# EAGLE schematic doorbell (EAGLE 9.1.3)
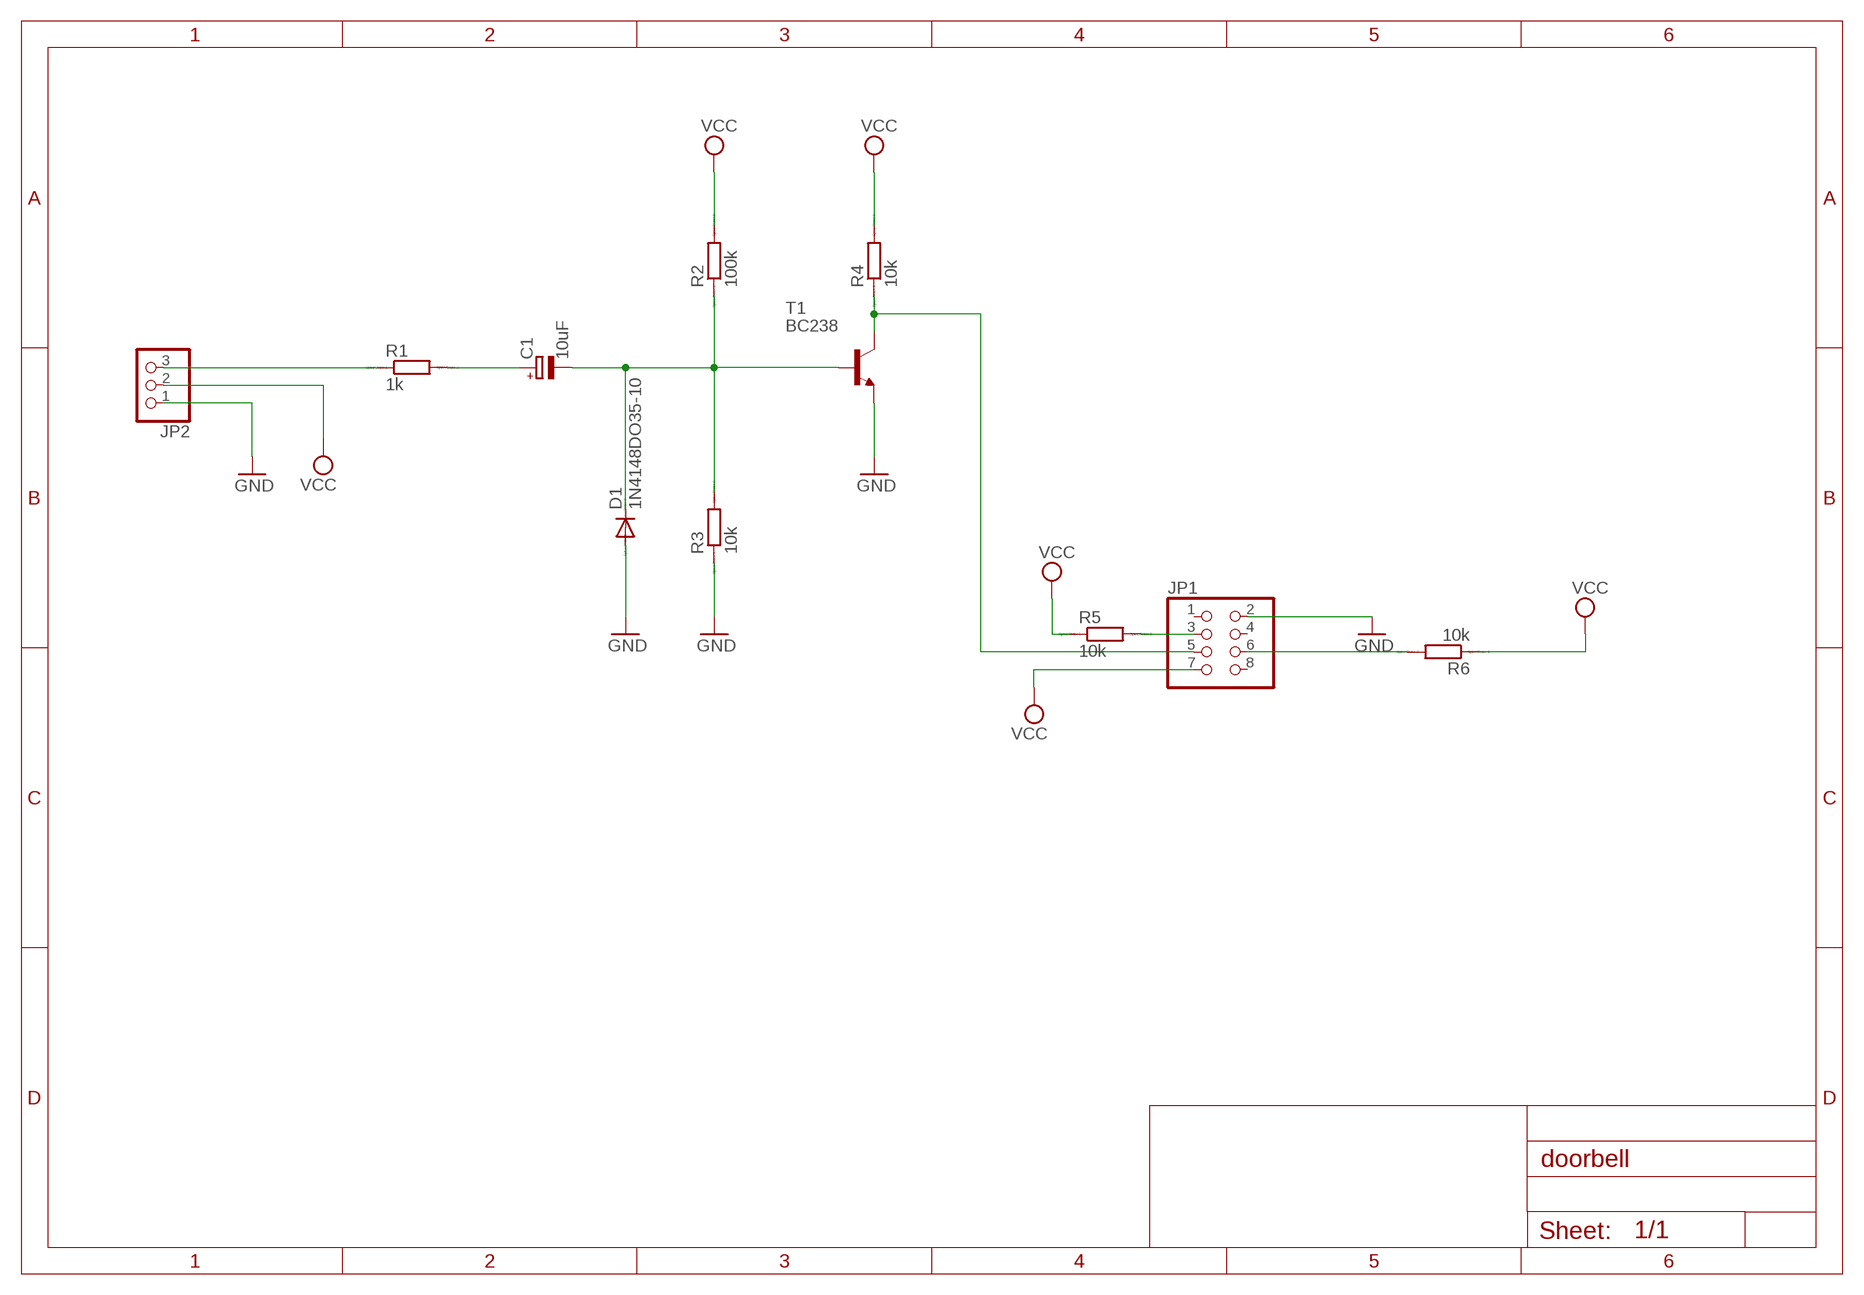
[diagram p0: schematic, sheet 1]

## Parts
C1  10uF  CPOL-EUE2,5-6E  [E2,5-6E]
D1  1N4148DO35-10  [DO35-10]
JP1  PINHD-2X4  [2X04]
JP2  PINHD-1X3  [1X03]
R1  1k  R0207/10  [0207/10]
R2  100k  R0207/10  [0207/10]
R3  10k  R0207/10  [0207/10]
R4  10k  R0207/10  [0207/10]
R5  10k  R0207/10  [0207/10]
R6  10k  R0207/10  [0207/10]
T1  BC238  [TO92]

## Nets
GND: D1.A JP1.2 JP2.1 R3.1 T1.1(E)
N$1: C1.+ R1.2
N$2: C1.- D1.C R2.1 R3.2 T1.2(B)
N$3: JP1.5 R4.1 T1.3(C)
N$4: JP1.6 R6.2
N$5: JP1.3 R5.2
N$6: JP2.3 R1.1
VCC: JP1.7 JP2.2 R2.2 R4.2 R5.1 R6.1
Unconnected: JP1.1 JP1.4 JP1.8

## Library data of the parts
C1 = rcl:CPOL-EU: POLARIZED CAPACITOR, European symbol
D1 = diode:1N4148: DIODE high speed (Philips)
JP1 = pinhead:PINHD-2X4: PIN HEADER
JP2 = pinhead:PINHD-1X3: PIN HEADER
R1-R6 = eagle-ltspice:R: RESISTOR, European symbol; SPICEMODEL: NONE; SPICEPREFIX: R
T1 = transistor:BC238: NPN TRANSISTOR